# EasyEDA Pro project 红外LED_V3.0.epro

# Schematic 红外LED_V3.0
Board Name: 红外LED_V3.0; Create Date: 2025-03-07; Page Name: P1; Project Name: 红外led; Schematic Name: 红外LED_V3.0; Update Date: 2025-03-14; Company: 嘉立创EDA; Page Size: A4; Version: V1.0
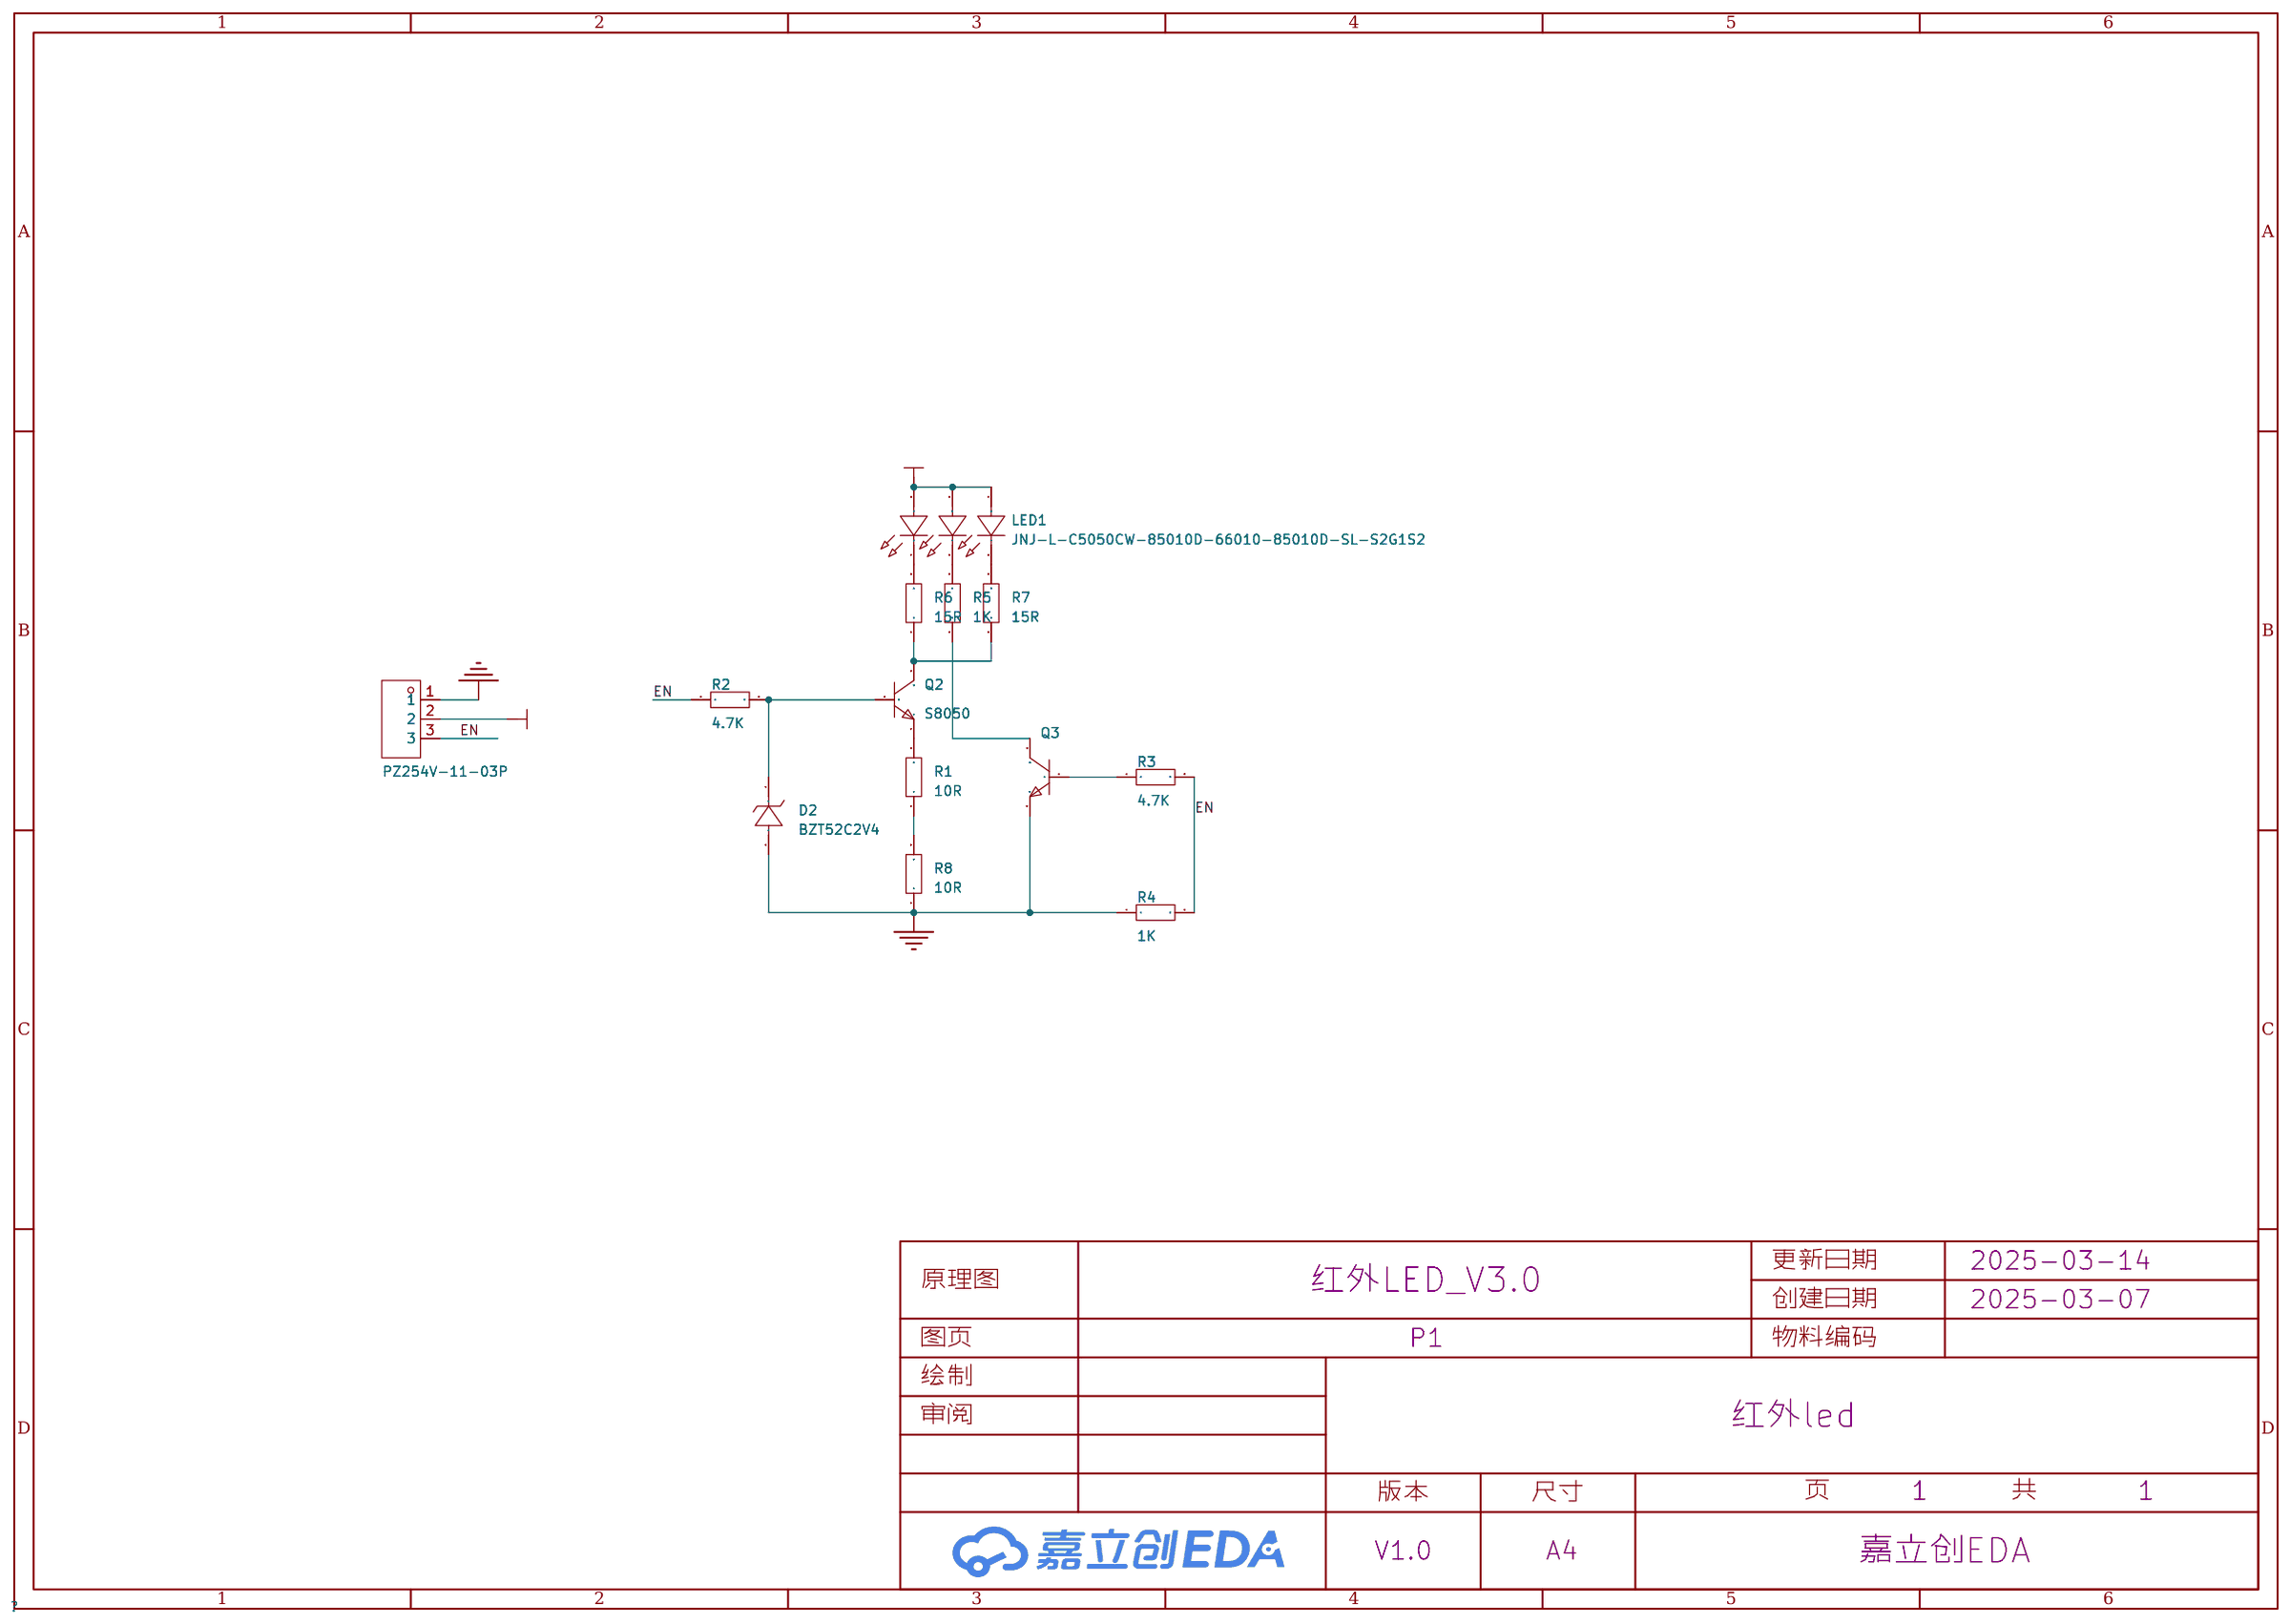
[diagram p0: schematic sheet]

## Parts
D2  BZT52C2V4  [SOD-123_L2.7-W1.6-LS3.7-RD]
H1  PZ254V-11-03P  [HDR-TH_3P-P2.54-V-M]
LED1  JNJ-L-C5050CW-85010D-66010-85010D-SL-S2G1S2  [LED-SMD_6P-L5.0-W5.0-P1.50-LS5.4-BL-1]
Q2  S8050  [SOT-23-3_L2.9-W1.3-P1.90-LS2.3-BR]
Q3  -  [S8050_SOT-23]
R1  10R  [R0805]
R2  4.7K  [R0603]
R3  4.7K  [R0603]
R4  1K  [R0603]
R5  1K  [R0603]
R6  15R  [R0603]
R7  15R  [R0603]
R8  10R  [R0805]

## Library data of the parts
D2 = BZT52C2V4_C22375296: 二极管配置:独立式;稳压值(标称值):2.4V;稳压值(范围):2.2V~2.6V;耗散功率(Pd):350mW;; Supplier Part: C22375296; Manufacturer: 宏嘉诚; Supplier Footprint: SOD-123; JLCPCB Part Class: 扩展库; Datasheet: https://atta.szlcsc.com/upload/public/pdf/source/20250106/E12AA82D484C9C66E469D005F460C1F7.pdf; Supplier: LCSC; Diode Configuration: 独立式; Zener Voltage(Nom): 2.4V; Reverse Leakage Current (Ir): 50uA@1V; Zener Voltage(Range): 2.2V~2.6V; Pd - Power Dissipation(Pd): 350mW; Impedance(Zzt): 100Ω
H1 = PZ254V-11-03P: 插针结构:1x3P;间距:2.54mm;行距:-;圆针/方针:方针;安装类型:直插;排数:单排;总PIN位数:3P;额定电流:3A;额定电压:250V;配合针长度:6mm;塑高:2.5mm;端接针长度:3mm;工作温度范围:-40℃~+105℃;颜色:黑色;; LCSC Part Name: 间距:2.54mm 1x3P 直插 方针; Supplier Part: C2937625; Manufacturer: XFCN(兴飞); Supplier Footprint: 插件,P=2.54mm; JLCPCB Part Class: 扩展库; Datasheet: https://atta.szlcsc.com/upload/public/pdf/source/20200309/C492402_8335C3D49C4E4C618838D59BB1D024C1.pdf; Supplier: LCSC; Pin Structure: 1x3P; Pitch: 2.54mm; Circluar Pins/Square Pins: 方针; Mounting Type: 直插; Number of Rows: 单排; Number of Pins: 3P; Current Rating (Max): 3A; Voltage Rating (Max): 250V; Length of Mating Pin: 6mm; Insulation Height: 2.5mm; Length of End Connection Pin: 3mm; Operating Temperature Range: -40℃~+105℃; Color: 黑色
LED1 = JNJ-L-C5050CW-85010D-66010-85010D-SL-S2G1S2: 正向压降(Vf):2.4V;功率:-;波长:850nm；660nm;二极管配置:-;透镜颜色:无色透明透镜;色温:-;发光强度:300mcd;发光角度:125°;工作温度:-40℃~+100℃;; LCSC Part Name: 3535三芯/125度/红外850nm10mil-Dx2+红光660nm10mil; Supplier Part: C42375668; Manufacturer: JNJ OPTOELECTRONICS(强生光电); Supplier Footprint: SMD5050-6P; JLCPCB Part Class: 扩展库; Datasheet: https://atta.szlcsc.com/upload/public/pdf/source/20241101/EAB7AE210DC3C15882DC399939750C0D.pdf; Supplier: LCSC; Voltage - Forward(Vf): 2.4V; Wavelength - Dominant: 850nm；660nm; Lens Color: 无色透明透镜; Luminous Intensity: 300mcd; Viewing Angle: 125°; Operating Temperature: -40℃~+100℃
Q2 = S8050_C20069125: 晶体管类型:NPN;集电极电流(Ic):500mA;集射极击穿电压(Vceo):25V;功率(Pd):300mW;直流电流增益(hFE@Ic,Vce):120@50mA,1.0V;; LCSC Part Name: hFE:200-350，丝印:J3Y; Supplier Part: C20069125; Manufacturer: 宏迦橙; Supplier Footprint: SOT-23; JLCPCB Part Class: 扩展库; Datasheet: https://atta.szlcsc.com/upload/public/pdf/source/20240403/2D78449C96B6E27F13BF8BDF79E27159.pdf; Supplier: LCSC; Transistor Type: NPN; Collector Current (Ic): 500mA; Collector-Emitter Breakdown Voltage (Vceo): 25V; Power Dissipation (Pd): 300mW; DC Current Gain (hFE@Ic,Vce): 120@50mA,1.0V; Transition Frequency (fT): 100MHz; Collector Cut-Off Current (Icbo): 100nA; Collector-Emitter Saturation Voltage (VCE(sat)@Ic,Ib): 600mV@500mA,50mA; Operating Temperature: -55℃~+150℃
Q3 = S8050_SOT_NPN: Supplier Footprint: SOT-23
R1 R8 = Res_0805: Supplier Footprint: 0805
R2-R7 = Res_0603: Supplier Footprint: 0603

## Nets
5V: H1.2 LED1.4(A) LED1.5(A) LED1.6(A)
GND: D2.2(A) H1.1 Q3.2 R4.1 R8.1
EN: H1.3 R2.1 R3.2 R4.2
$1N403: Q2.3(C) R6.1 R7.1
$1N1582: D2.1(K) Q2.1(B) R2.2
$1N1615: Q2.2(E) R1.2
$1N1873: Q3.1 R3.1
$1N2057: LED1.1(K) R6.2
$1N2059: LED1.3(K) R7.2
$1N2078: LED1.2(K) R5.2
$1N2082: Q3.3 R5.1
$1N2459: R1.1 R8.2

# Board 红外LED_V3.0
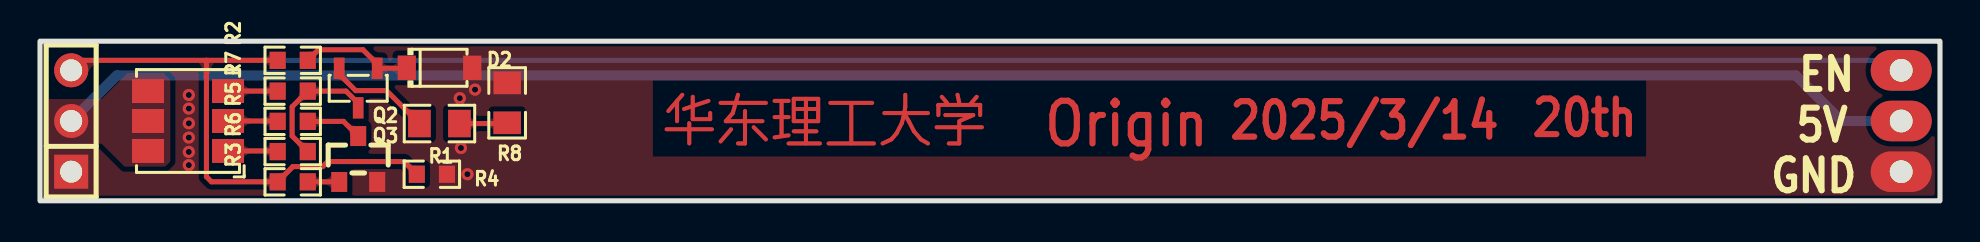
[diagram p1: board, top side]
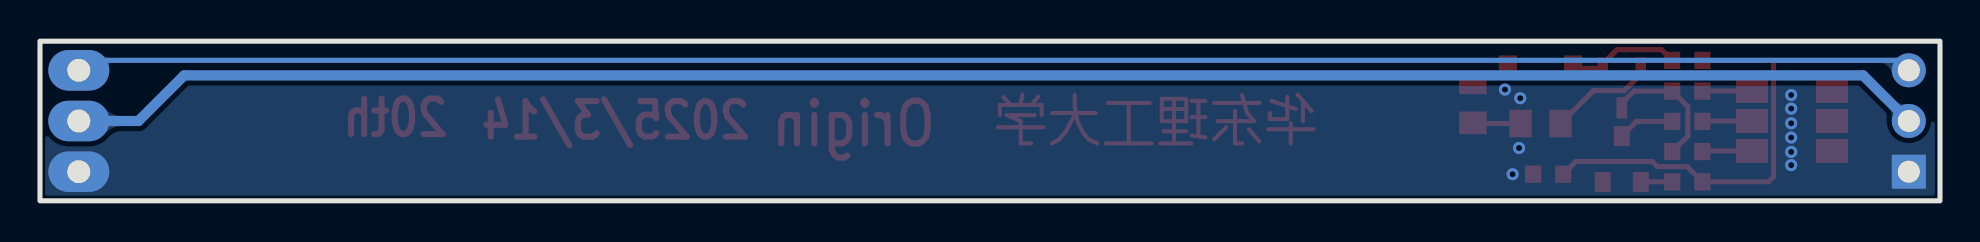
[diagram p2: board, bottom side, seen from below]

Outline 95 x 8 mm; copper layers: Top Layer, Bottom Layer. Coordinates in mm from the lower left corner of the outline.
Outline path: rectangle 0,8 95,0
Stack: Top Layer 0.035mm / Dielectric1 1.51mm FR4 er 4.5 / Bottom Layer 0.035mm

## Design rules (mm)
template: 4层
spacing copperThickness1oz (default): track to track 0.102, other pairs 0.152 to 0.3
spacing copperThickness2oz: track to track 0.203, other pairs 0.152 to 0.3
spacing copperThicknessInner0.5oz: track to track 0.089, other pairs 0.152 to 0.3
track width copperThickness1oz (default): min 0.102, default 0.254, max 2.54
track width copperThickness2oz: min 0.203, default 0.254, max 2.54
track width copperThickness0.5oz: min 0.089, default 0.254, max 2.54
differential pair differentialPair (default): width min 0.127, default 0.254, max 2.54; gap min 0.152, default 0.152
via viaSize (default): diameter min 0.3, default 0.61, max 10; hole min 0.2, default 0.305, max 6.3

## Placement (name value [footprint] x y rotation side)
D2  BZT52C2V4  [SOD-123_L2.7-W1.6-LS3.7-RD]  19.97 6.67 0 top
H1  PZ254V-11-03P  [HDR-TH_3P-P2.54-V-M]  1.56 4 90 top
LED1  JNJ-L-C5050CW-85010D-66010-85010D-SL-S2G1S2  [LED-SMD_6P-L5.0-W5.0-P1.50-LS5.4-BL-1]  7.4 4 90 top
NOREF  -  [Pad_e40]  93.06 6.54 0 top
NOREF#2  -  [Pad_e37]  93.06 4 0 top
NOREF#3  -  [Pad_e41]  93.06 1.46 0 top
Q2  S8050  [SOT-23-3_L2.9-W1.3-P1.90-LS2.3-BR]  15.91 5.65 90 top
Q3  -  [S8050_SOT-23]  15.78 2.09 270 top
R1  10R  [R0805]  19.97 3.87 180 top
R2  4.7K  [R0603]  12.64 7.04 0 top
R3  4.7K  [R0603]  12.64 0.95 180 top
R4  1K  [R0603]  19.59 1.33 180 top
R5  1K  [R0603]  12.64 3.98 180 top
R6  15R  [R0603]  12.64 2.47 180 top
R7  15R  [R0603]  12.64 5.5 180 top
R8  10R  [R0805]  23.36 4.91 270 top

## Footprints (pads in the part's own frame, mm; a bottom-side part is the same pattern mirrored in y, then rotated)
HDR-TH_3P-P2.54-V-M
  rect 1.7x1.7 hole 1.1: 1(-2.54,0)
  round 1.7 hole 1.1: 2(0,0) 3(2.54,0)
LED-SMD_6P-L5.0-W5.0-P1.50-LS5.4-BL-1
  rect 1.2x1.6 smd: 1(-1.5,-2) 2(0,-2) 3(1.5,-2) 4(1.5,2) 5(0,2) 6(-1.5,2)
Pad_e37
  oval 3.048x2.032 hole 1.143: 1(0,0)
Pad_e40
  oval 3.048x2.032 hole 1.143: 1(0,0)
Pad_e41
  oval 3.048x2.032 hole 1.143: 1(0,0)
R0603
  rect 0.806x0.864 smd: 1(-0.753,0) 2(0.753,0)
R0805
  rect 1.133x1.377 smd: 1(-1,0) 2(1,0)
S8050_SOT-23
  rect 1x0.8 smd: 1(1.15,-0.823) 2(1.15,1.077) 3(-1.15,0.127)
SOD-123_L2.7-W1.6-LS3.7-RD
  rect 0.91x1.22 smd: 1(-1.635,0) 2(1.635,0)
SOT-23-3_L2.9-W1.3-P1.90-LS2.3-BR
  rect 1.07x0.532 smd: 1(0.99,-0.95) 2(0.99,0.95) 3(-0.99,0)

## Nets
5V: H1.2 LED1.4 LED1.5 LED1.6 NOREF#2.1
GND: D2.2 H1.1 NOREF#3.1 Q3.2 R4.1 R8.1
EN: H1.3 NOREF.1 R2.1 R3.2 R4.2
$1N403: Q2.3 R6.1 R7.1
$1N1582: D2.1 Q2.1 R2.2
$1N1615: Q2.2 R1.2
$1N1873: Q3.1 R3.1
$1N2057: LED1.1 R6.2
$1N2059: LED1.3 R7.2
$1N2078: LED1.2 R5.2
$1N2082: Q3.3 R5.1
$1N2459: R1.1 R8.2

## Via types
v1: diameter 0.61, hole 0.305, Top Layer to Bottom Layer, 10 vias

## Routing (per net, layer and track width the routed paths; a pad name or vN(x,y) marks a point on that pad's centre or on a via; arc(x,y) is an arc through that point)
5V: length 93.4
  Bottom Layer w0.508: NOREF#2.1 90.08,4 87.79,6.29 3.84,6.29 H1.2
GND:
  vias: v1(7.44,5.3) v1(7.44,4.62) v1(7.44,3.89) v1(7.44,3.17) v1(7.44,2.45) v1(7.44,1.79) v1(20.99,5.14) v1(21.05,2.65) v1(21.37,1.33) v1(21.75,5.58)
EN: length 119.6
  Top Layer w0.254: R2.1 8.32,7.04 ; 8.32,7.04 2.06,7.04 H1.3 ; 8.32,7.04 8.32,1.21 8.58,0.95 R3.2 12.64,1.71 14.13,1.71 14.39,1.97 18.2,1.97 R4.2
  Bottom Layer w0.254: NOREF.1 92.56,7.04 2.06,7.04 H1.3
$1N403: length 6.7
  Top Layer w0.254: R6.1 12.61,3.25 12.61,4.72 R7.1 15.3,5.5 15.91,4.89 Q2.3
$1N1582: length 5.8
  Top Layer w0.254: 18.45,6.67 18.43,6.64 Q2.1 16.86,6.86 16.15,7.57 13.92,7.57 R2.2
$1N1615: length 5.3
  Top Layer w0.254: R1.2 17.32,5.52 15.78,5.52 14.96,6.35 Q2.2
$1N1873: length 1.6
  Top Layer w0.254: Q3.1 14.95,0.95 R3.1
$1N2057: length 2.5
  Top Layer w0.254: LED1.1 11.85,2.5 R6.2
$1N2059: length 2.5
  Top Layer w0.254: R7.2 11.88,5.5 LED1.3
$1N2078: length 2.5
  Top Layer w0.254: R5.2 11.86,4 LED1.2
$1N2082: length 2.8
  Top Layer w0.254: Q3.3 15.17,3.98 R5.1
$1N2459: length 2.1
  Top Layer w0.254: 23.1,3.91 23.07,3.87 R1.1

## Copper pours and planes (outline as drawn; the poured copper is in the pictures)
5V on Top Layer: 0,5.1 3.08,5.1 4.39,6.41 6.16,6.41 6.51,6.05 6.51,1.97 6.26,1.71 4.23,1.71 3.08,2.86 0,2.86
GND on Top Layer: 0,8 95,8 95,0 0,0
GND on Bottom Layer: 0,8 95,8 95,0 0,0

Small or netless copper shapes (teardrops, artwork), in the pictures only: 27 on Top Layer, 4 on Bottom Layer

## Text on the board
Top Layer: 2025/3/14 | 20th | Origin | 华东理工大学
Top Solder Mask Layer: 2025/3/14 | 20th | Origin | 华东理工大学
Top Silkscreen Layer: GND | 5V | EN
